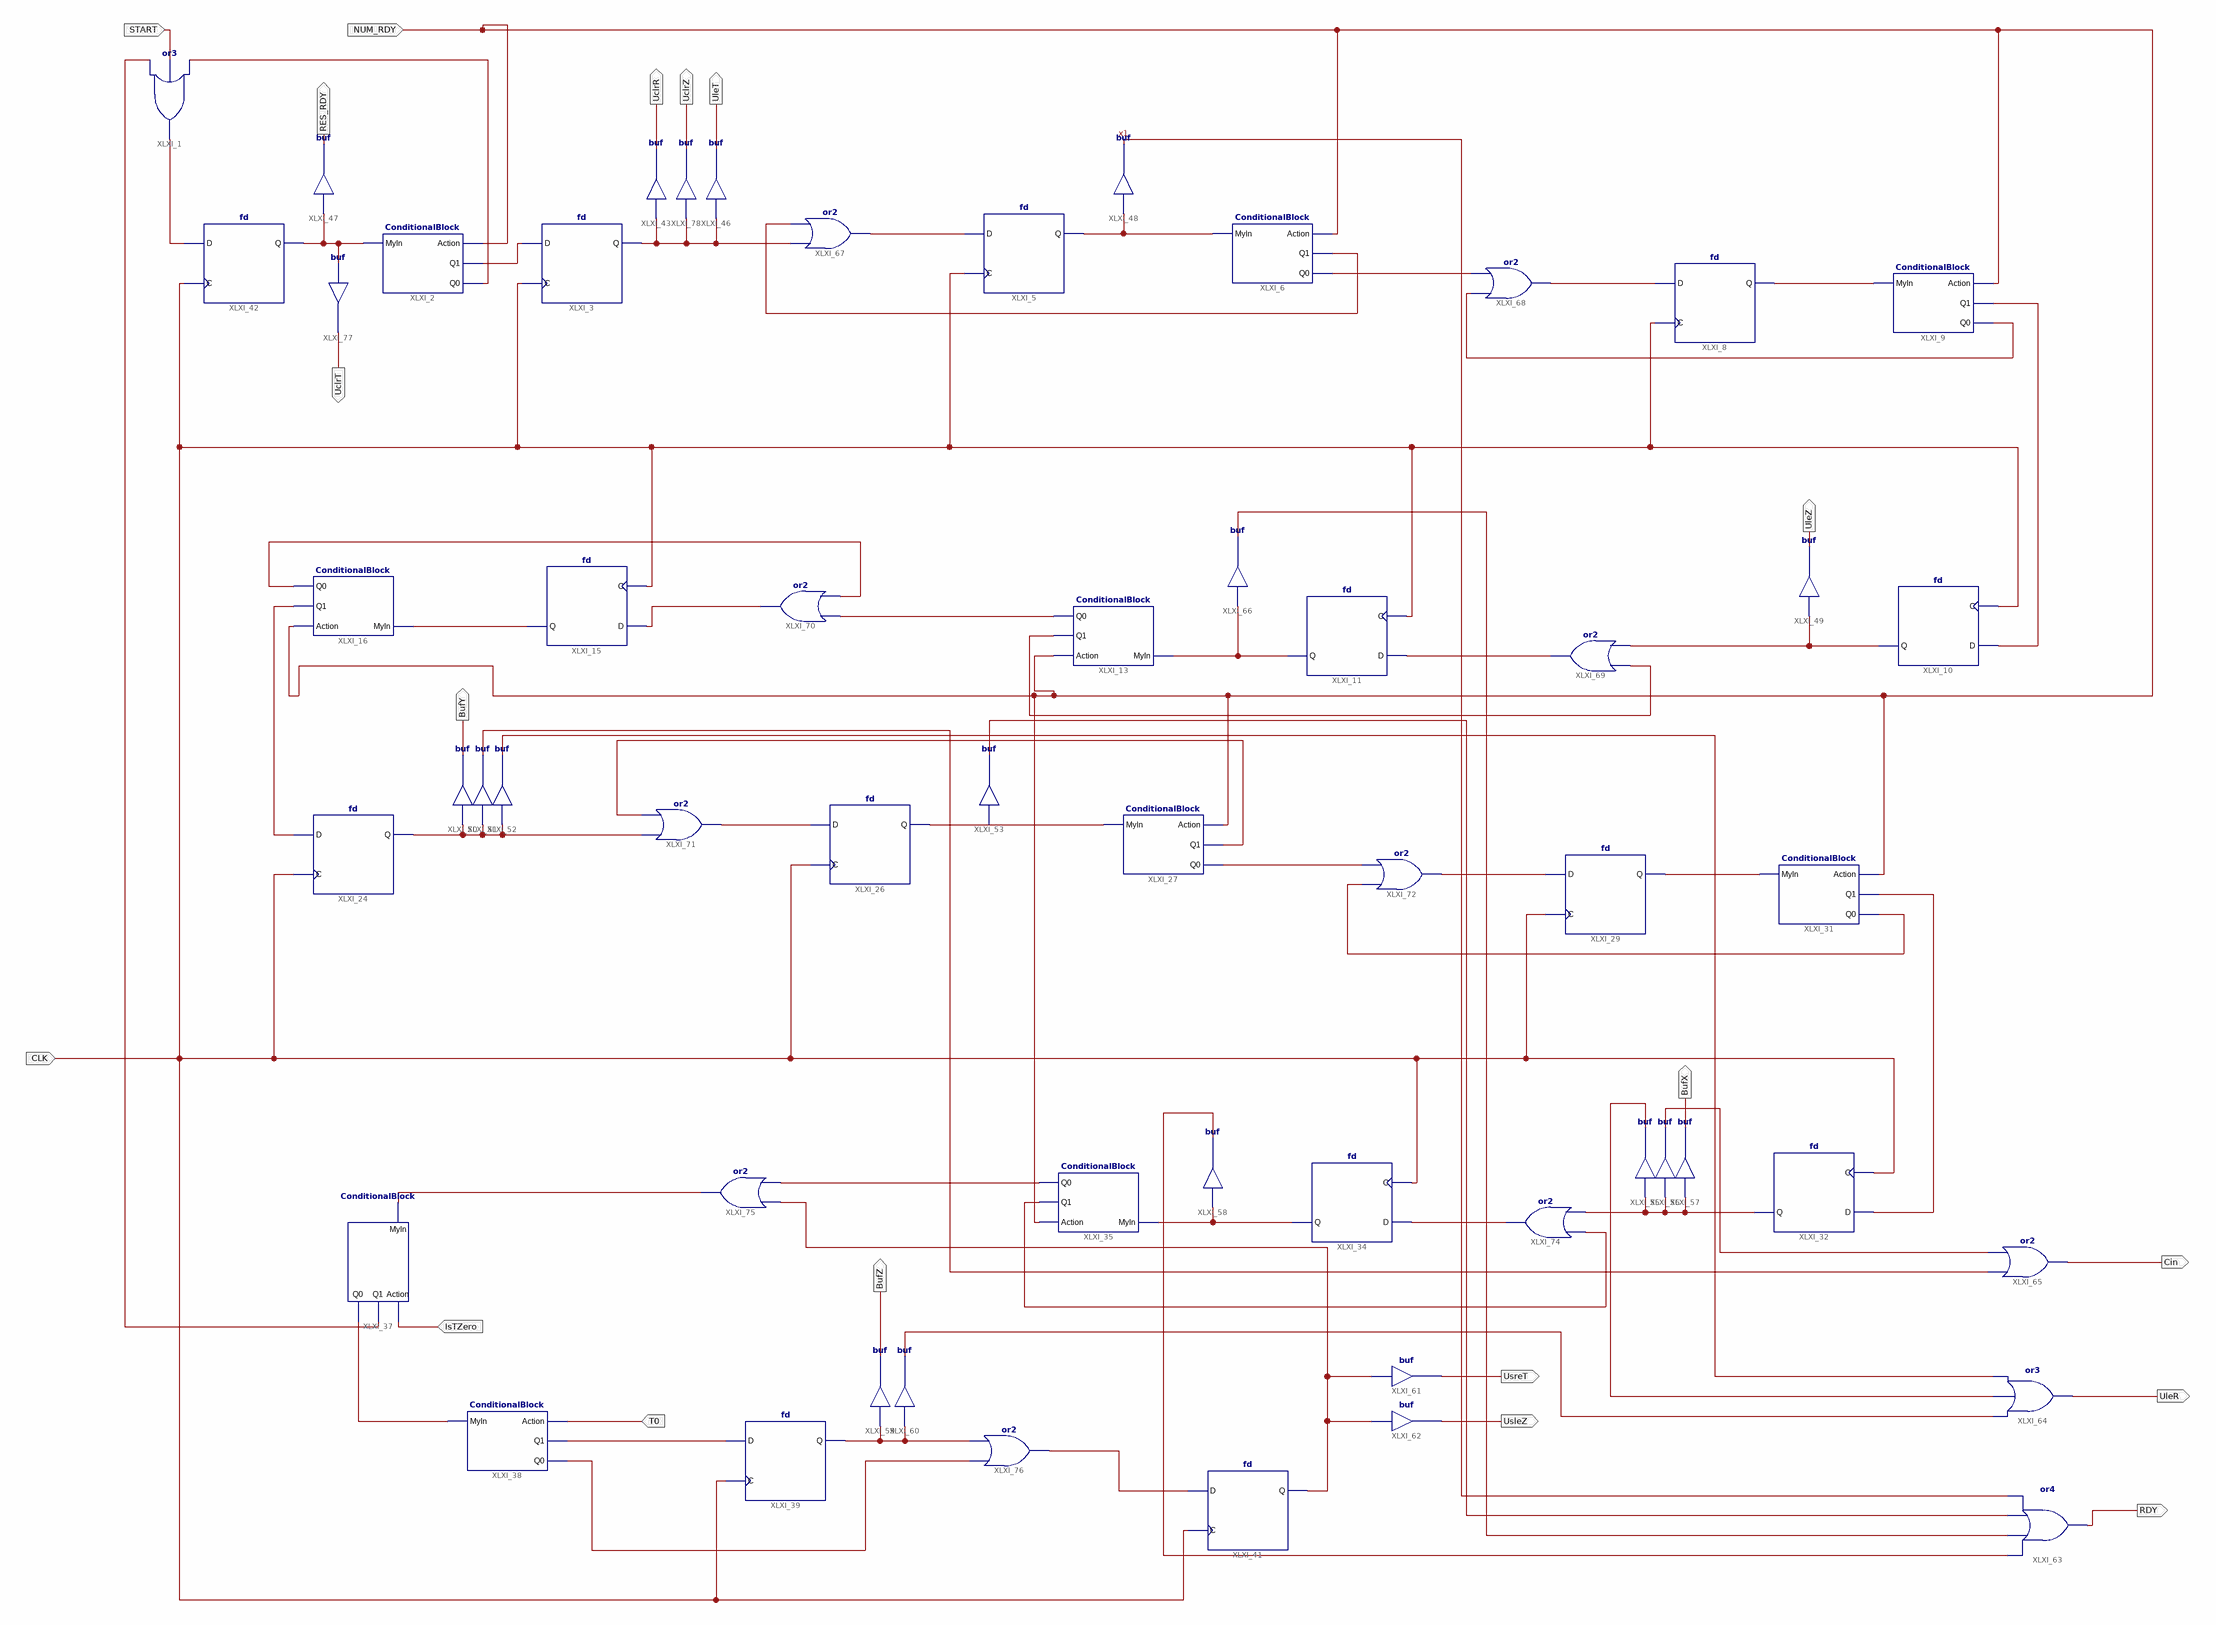
[diagram p0: schematic sheet 1]
// Xilinx ISE schematic ControlUnit.sch (spartan3a) as structural Verilog: 57 symbols, 19 ports
module ControlUnit (
  input  NUM_RDY,
  input  CLK,
  input  IsTZero,
  input  T0,
  input  START,
  output UclrR,
  output UleT,
  output RES_RDY,
  output RDY,
  output UleZ,
  output BufY,
  output BufX,
  output BufZ,
  output UsreT,
  output UsleZ,
  output Cin,
  output UleR,
  output UclrZ,
  output UclrT
);

  wire x1, XLXN_40, XLXN_45, XLXN_46, XLXN_48, XLXN_49, XLXN_64, XLXN_65, XLXN_66, XLXN_68, XLXN_69, XLXN_71,
       XLXN_73, XLXN_75, XLXN_76, XLXN_77, XLXN_79, XLXN_80, XLXN_81, XLXN_83, XLXN_84, XLXN_85, XLXN_89,
       XLXN_91, XLXN_92, XLXN_96, XLXN_97, XLXN_99, XLXN_102, XLXN_103, XLXN_104, XLXN_107, XLXN_108,
       XLXN_109, XLXN_110, XLXN_114, XLXN_118, XLXN_119, XLXN_121, XLXN_122, XLXN_123, XLXN_125, XLXN_143,
       XLXN_144, XLXN_145, XLXN_146, XLXN_147, XLXN_148, XLXN_149, XLXN_150, XLXN_158, XLXN_160, XLXN_161;

  or XLXI_1 (XLXN_40, XLXN_161, START, XLXN_45);
  ConditionalBlock XLXI_2 (.Action(NUM_RDY), .MyIn(XLXN_160), .Q0(XLXN_45), .Q1(XLXN_46));
  fd XLXI_3 (.C(CLK), .D(XLXN_46), .Q(XLXN_158));
  fd XLXI_5 (.C(CLK), .D(XLXN_48), .Q(XLXN_49));
  ConditionalBlock XLXI_6 (.Action(NUM_RDY), .MyIn(XLXN_49), .Q0(XLXN_65), .Q1(XLXN_64));
  fd XLXI_8 (.C(CLK), .D(XLXN_66), .Q(XLXN_68));
  ConditionalBlock XLXI_9 (.Action(NUM_RDY), .MyIn(XLXN_68), .Q0(XLXN_69), .Q1(XLXN_71));
  fd XLXI_10 (.C(CLK), .D(XLXN_71), .Q(XLXN_73));
  ConditionalBlock XLXI_16 (.Action(NUM_RDY), .MyIn(XLXN_80), .Q0(XLXN_83), .Q1(XLXN_84));
  fd XLXI_15 (.C(CLK), .D(XLXN_79), .Q(XLXN_80));
  fd XLXI_11 (.C(CLK), .D(XLXN_75), .Q(XLXN_76));
  ConditionalBlock XLXI_13 (.Action(NUM_RDY), .MyIn(XLXN_76), .Q0(XLXN_81), .Q1(XLXN_77));
  fd XLXI_24 (.C(CLK), .D(XLXN_84), .Q(XLXN_85));
  fd XLXI_26 (.C(CLK), .D(XLXN_89), .Q(XLXN_91));
  ConditionalBlock XLXI_27 (.Action(NUM_RDY), .MyIn(XLXN_91), .Q0(XLXN_92), .Q1(XLXN_96));
  fd XLXI_29 (.C(CLK), .D(XLXN_97), .Q(XLXN_99));
  ConditionalBlock XLXI_31 (.Action(NUM_RDY), .MyIn(XLXN_99), .Q0(XLXN_102), .Q1(XLXN_103));
  fd XLXI_32 (.C(CLK), .D(XLXN_103), .Q(XLXN_104));
  fd XLXI_34 (.C(CLK), .D(XLXN_107), .Q(XLXN_108));
  ConditionalBlock XLXI_35 (.Action(NUM_RDY), .MyIn(XLXN_108), .Q0(XLXN_109), .Q1(XLXN_110));
  ConditionalBlock XLXI_37 (.Action(IsTZero), .MyIn(XLXN_114), .Q0(XLXN_118), .Q1(XLXN_161));
  ConditionalBlock XLXI_38 (.Action(T0), .MyIn(XLXN_118), .Q0(XLXN_122), .Q1(XLXN_119));
  fd XLXI_39 (.C(CLK), .D(XLXN_119), .Q(XLXN_121));
  fd XLXI_41 (.C(CLK), .D(XLXN_123), .Q(XLXN_125));
  fd XLXI_42 (.C(CLK), .D(XLXN_40), .Q(XLXN_160));
  buf XLXI_43 (UclrR, XLXN_158);
  buf XLXI_46 (UleT, XLXN_158);
  buf XLXI_47 (RES_RDY, XLXN_160);
  buf XLXI_48 (x1, XLXN_49);
  buf XLXI_49 (UleZ, XLXN_73);
  buf XLXI_50 (BufY, XLXN_85);
  buf XLXI_51 (XLXN_144, XLXN_85);
  buf XLXI_52 (XLXN_145, XLXN_85);
  buf XLXI_53 (XLXN_148, XLXN_91);
  buf XLXI_55 (XLXN_146, XLXN_104);
  buf XLXI_56 (XLXN_143, XLXN_104);
  buf XLXI_57 (BufX, XLXN_104);
  buf XLXI_58 (XLXN_150, XLXN_108);
  buf XLXI_59 (BufZ, XLXN_121);
  buf XLXI_60 (XLXN_147, XLXN_121);
  buf XLXI_61 (UsreT, XLXN_125);
  buf XLXI_62 (UsleZ, XLXN_125);
  or XLXI_63 (RDY, XLXN_150, XLXN_149, XLXN_148, x1);
  or XLXI_64 (UleR, XLXN_147, XLXN_146, XLXN_145);
  or XLXI_65 (Cin, XLXN_144, XLXN_143);
  buf XLXI_66 (XLXN_149, XLXN_76);
  or XLXI_67 (XLXN_48, XLXN_158, XLXN_64);
  or XLXI_68 (XLXN_66, XLXN_69, XLXN_65);
  or XLXI_69 (XLXN_75, XLXN_73, XLXN_77);
  or XLXI_70 (XLXN_79, XLXN_83, XLXN_81);
  or XLXI_71 (XLXN_89, XLXN_85, XLXN_96);
  or XLXI_72 (XLXN_97, XLXN_102, XLXN_92);
  or XLXI_74 (XLXN_107, XLXN_104, XLXN_110);
  or XLXI_75 (XLXN_114, XLXN_109, XLXN_125);
  or XLXI_76 (XLXN_123, XLXN_122, XLXN_121);
  buf XLXI_77 (UclrT, XLXN_160);
  buf XLXI_78 (UclrZ, XLXN_158);
endmodule
